# Altium schematic sheet [02] - BLOCK Diagram.SchDoc
size A3; DocumentNumber: 2; SheetNumber: 2; SheetTotal: 5; PageSetup: Record=PageOptions|CenterHorizontal=True|CenterVertical=True|PrintScale=0.52|XCorrection=1.00|YCorrection=1.00|PrintKind=1|BorderSize=5000000|LeftOffset=0|BottomOffset=0|Orientation=2|PaperLength=1000|PaperWidth=1000|Scale=100|PaperSource=4|PrintQuality=600|MediaType=1|DitherType=10|PrintScaleMode=1|PaperKind=A4|PaperIndex=9
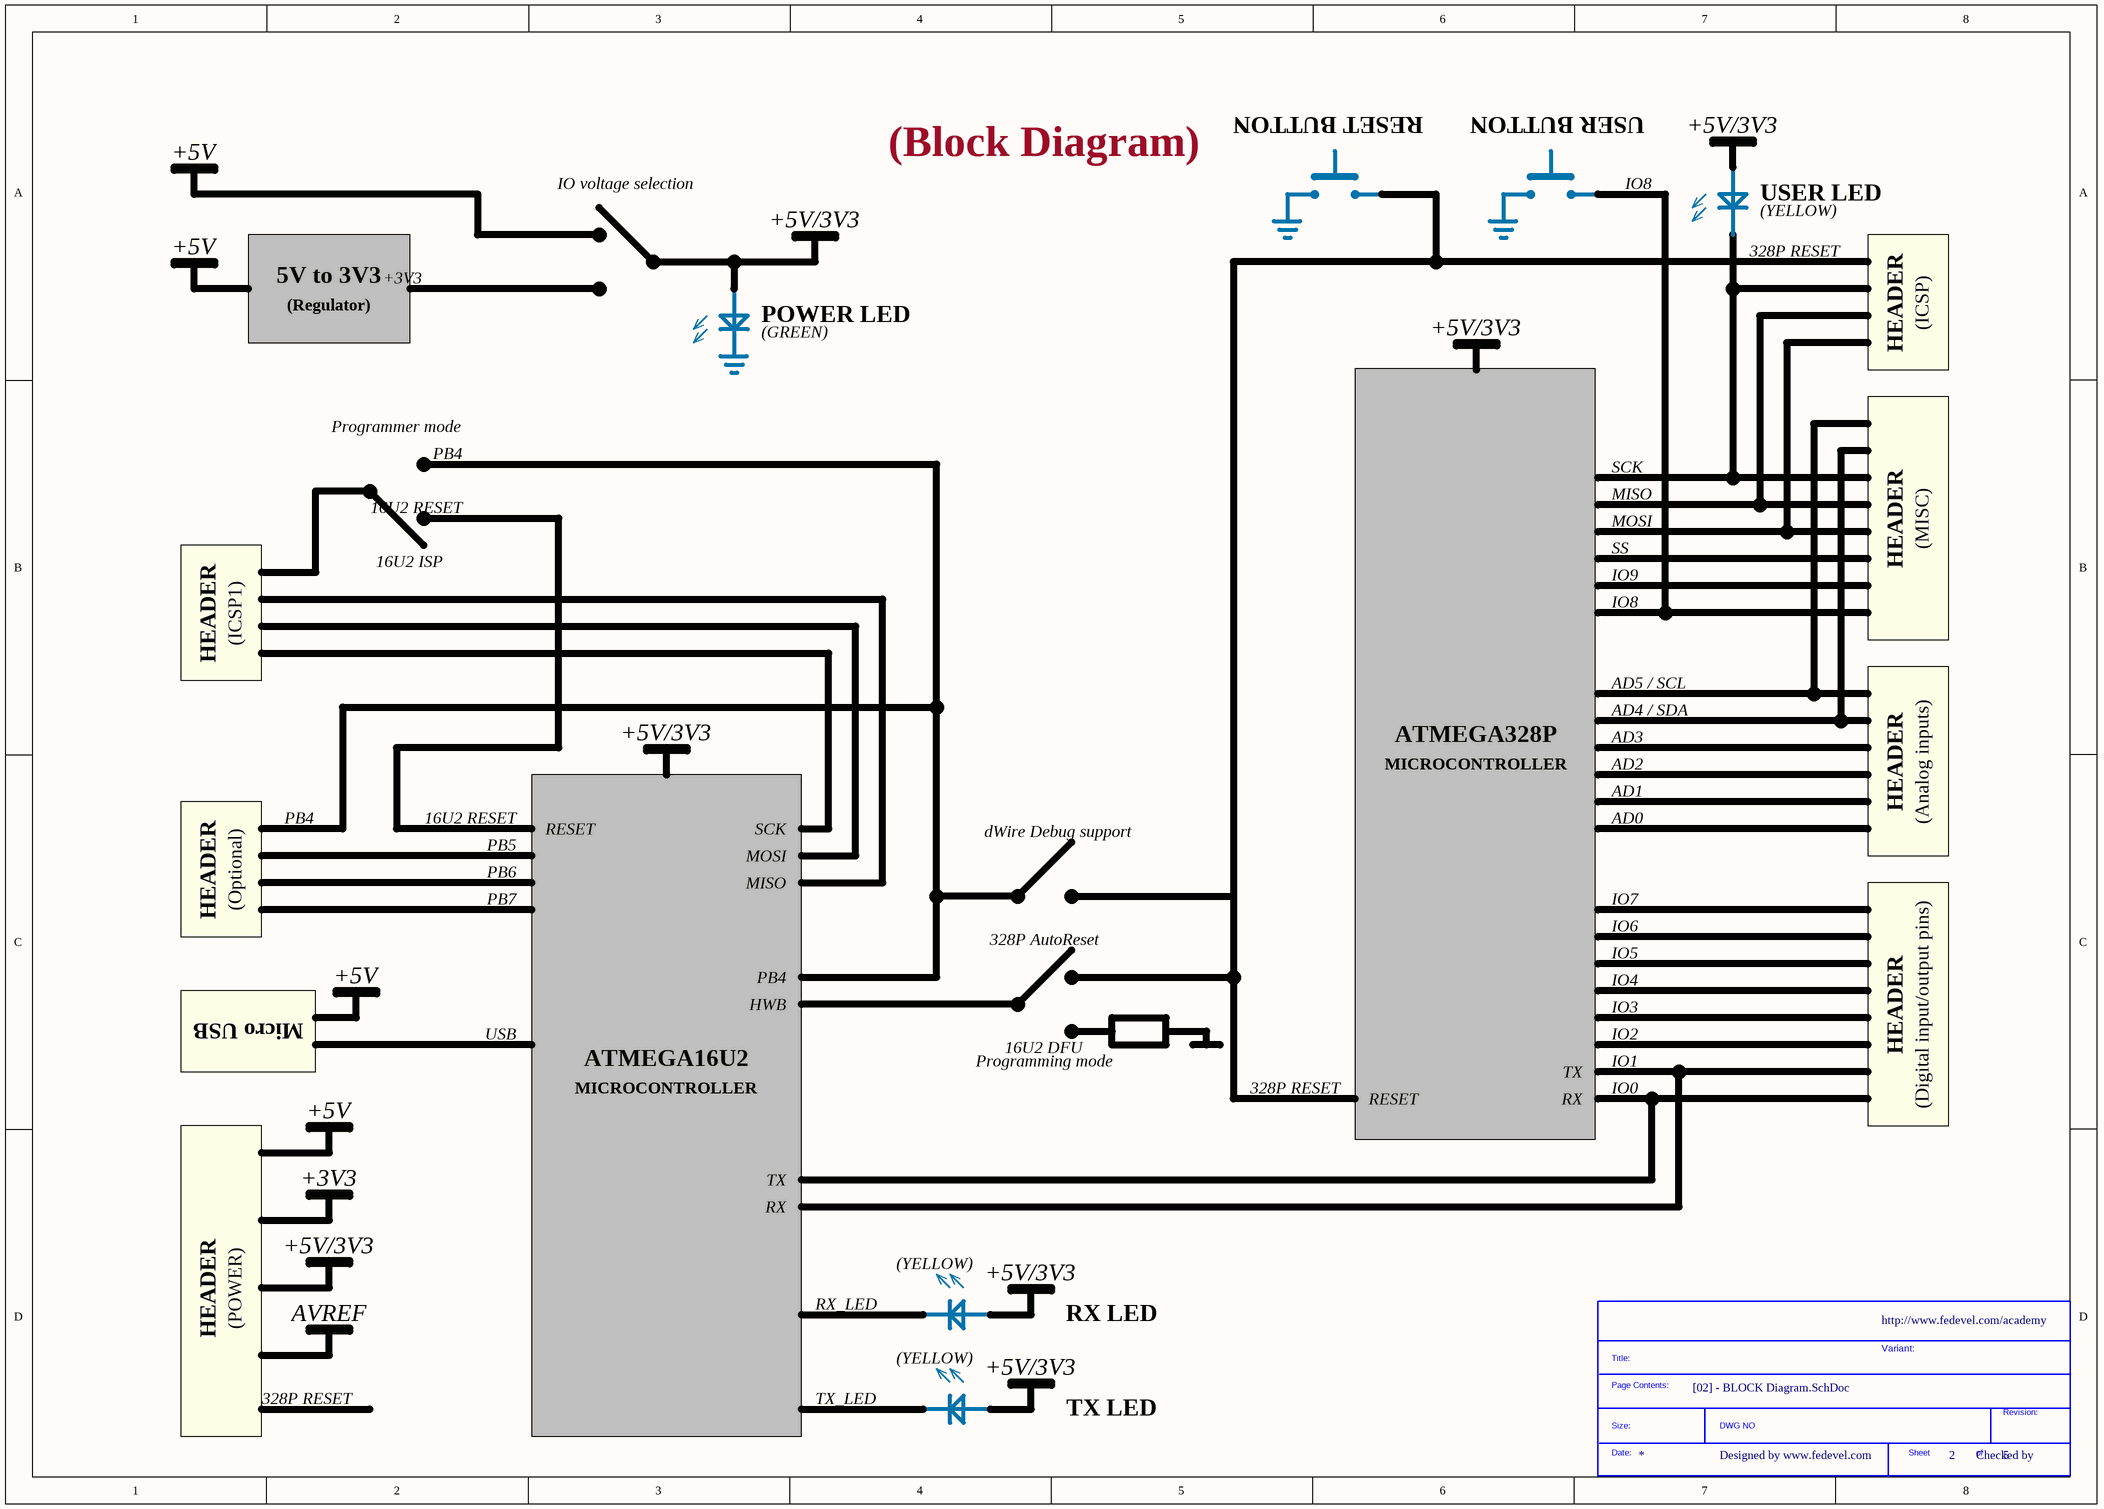
[diagram p0: [02] - BLOCK Diagram.SchDoc]

## Parts
*  SDTitleBlock  (value not drawn)  (graphical)

## Notes on the sheet
- +5V
- (Block Diagram)
- RESET BUTTON
- USER BUTTON
- +5V/3V3
- IO voltage selection
- IO8
- USER LED
- (YELLOW)
- 5V to 3V3
- (Regulator)
- +3V3
- 328P RESET
- HEADER
- (ICSP)
- POWER LED
- (GREEN)
- Programmer mode
- PB4
- 16U2 RESET
- MISO
- SCK
- (MISC)
- 16U2 ISP
- SS
- IO9
- MOSI
- (ICSP1)
- AD5 / SCL
- AD4 / SDA
- ATMEGA328P
- MICROCONTROLLER
- AD3
- AD2
- (Analog inputs)
- PB5
- RESET
- dWire Debug support
- AD1
- AD0
- (Optional)
- PB6
- PB7
- IO7
- 328P AutoReset
- IO6
- IO5
- IO4
- Micro USB
- USB
- ATMEGA16U2
- HWB
- 16U2 DFU
- IO3
- IO2
- (Digital input/output pins)
- Programming mode
- RX
- TX
- IO1
- IO0
- (POWER)
- AVREF
- RX_LED
- RX LED
- http://www.fedevel.com/academy
- Variant:
- TX_LED
- TX LED
- Designed by www.fedevel.com
- Checked by
- (in symbol SDTitleBlock) Title:; Page Contents:; Revision:; Size:; DWG NO; Date:; Sheet; of